# Altium schematic sheet Block_Diagram_2.SchDoc
size 558 x 431 mm; SheetNumber: 2; SheetTotal: 2
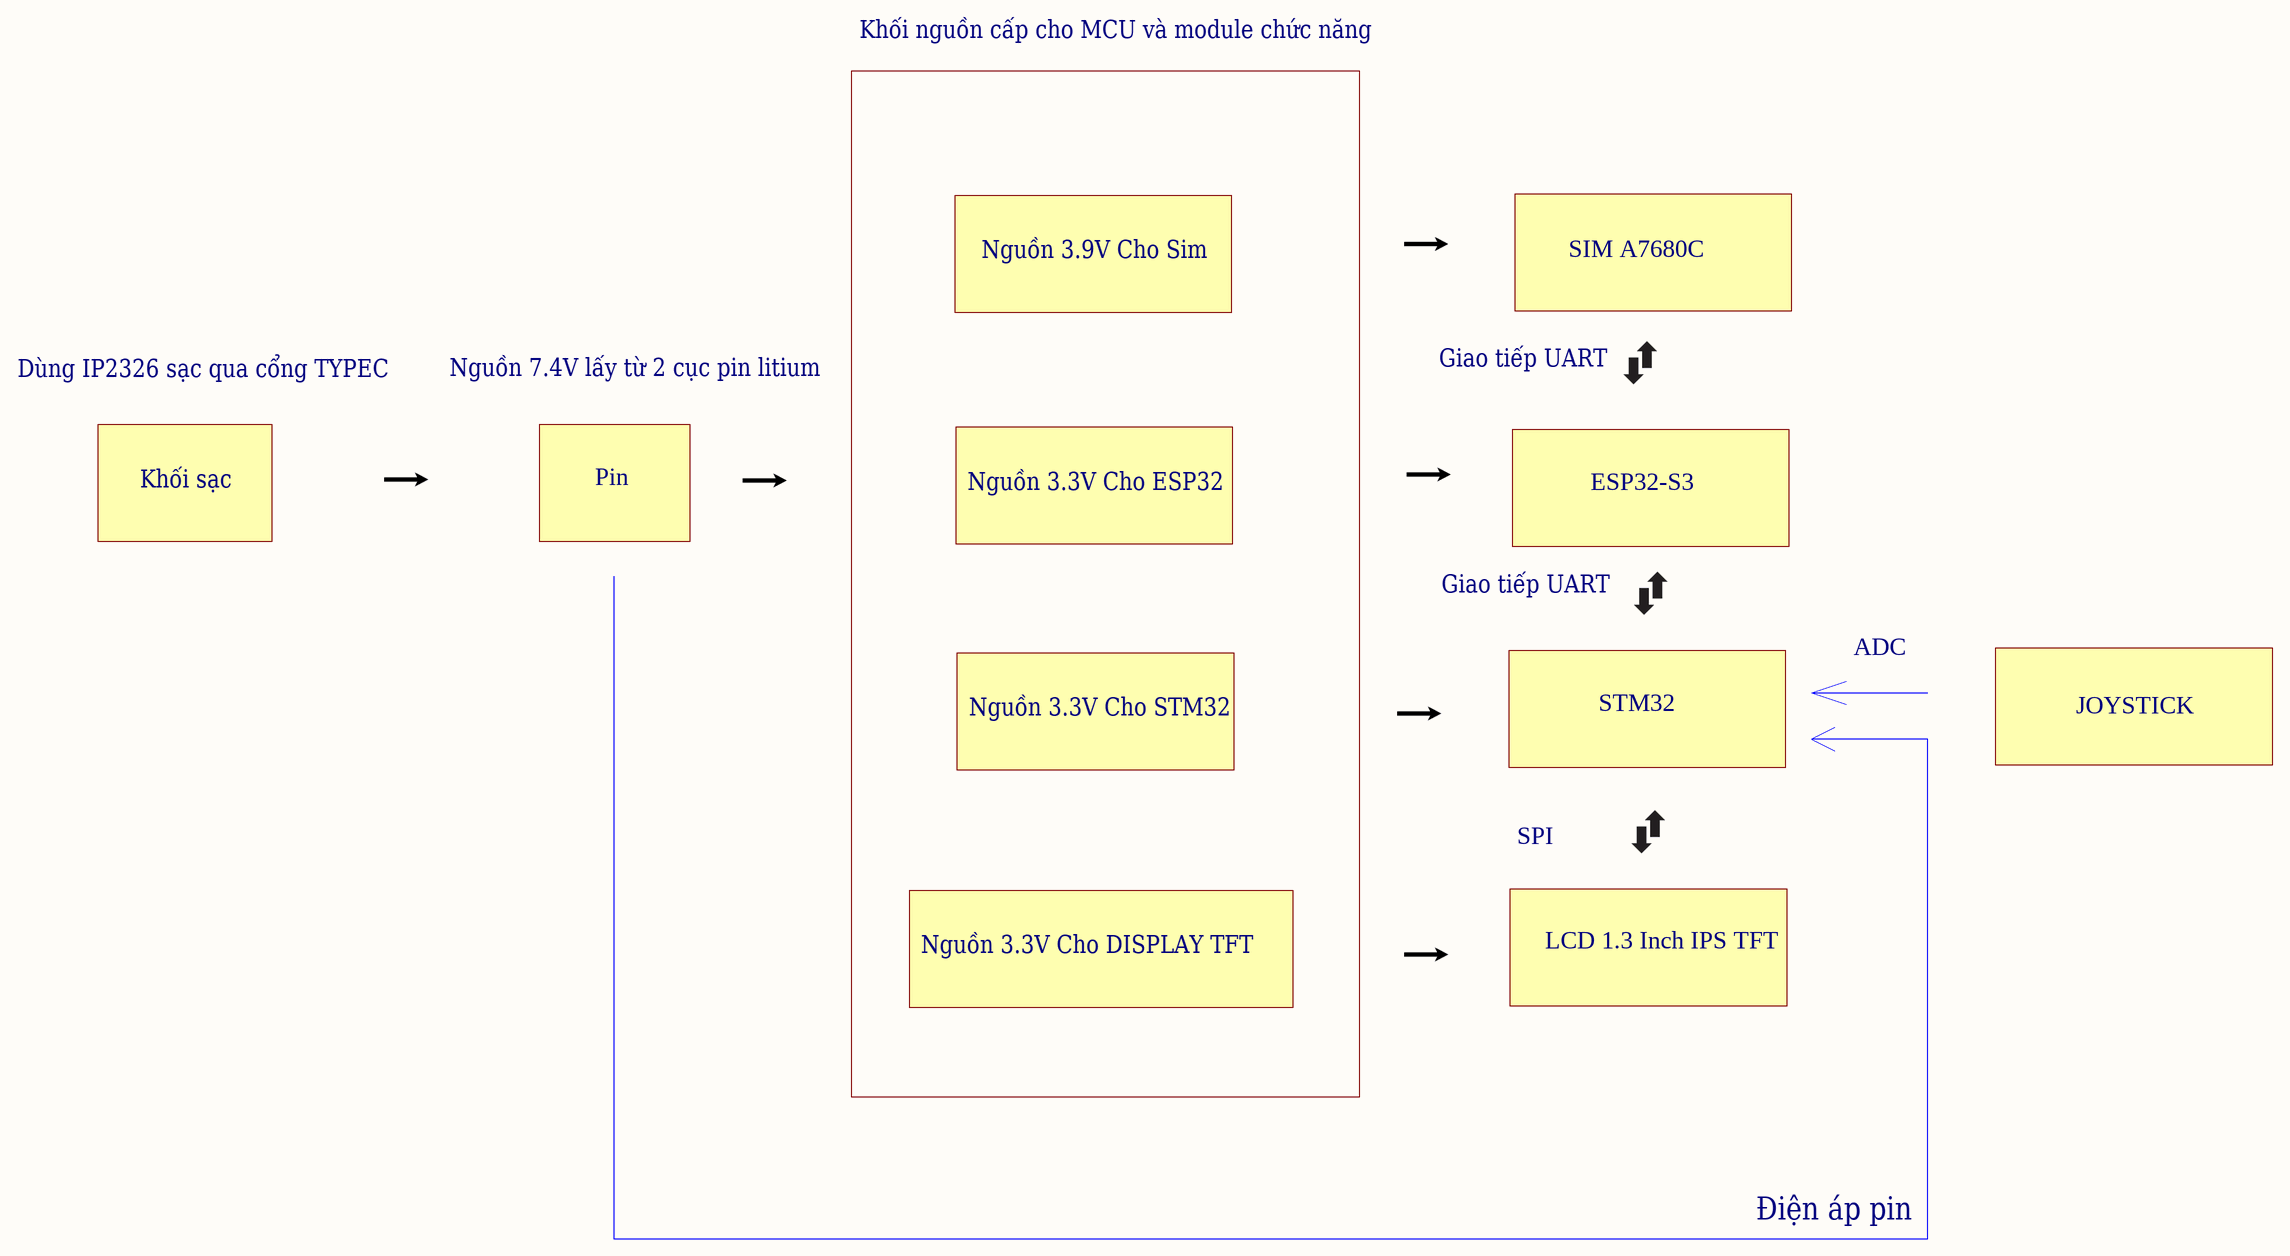
[diagram p0: Block_Diagram_2.SchDoc]

## Notes on the sheet
- Khối nguồn cấp cho MCU và module chức năng
- Nguồn 3.9V Cho Sim
- SIM A7680C
- Dùng IP2326 sạc qua cổng TYPEC
- Nguồn 7.4V lấy từ 2 cục pin litium
- Giao tiếp UART
- Khối sạc
- Pin
- Nguồn 3.3V Cho ESP32
- ESP32-S3
- ADC
- Nguồn 3.3V Cho STM32
- STM32
- JOYSTICK
- SPI
- Nguồn 3.3V Cho DISPLAY TFT
- LCD 1.3 Inch IPS TFT
- Điện áp pin
- DWG. NO.
- REV.
- SHT.
- REVISION
- DESCRIPTION
- DATE
- APPROVED
- THIS DOCUMENT AND THE DATA DISCLOSED HEREIN OR HEREWITH IS THE PROPERTY OF ALTIUM LIMITED AND MAY BE FREELY DISTRIBUTED IN WHOLE. NO RIGHTS ARE RESERVED OR EXPRESS OR IMPLIED WARANTEE GIVEN.
- ENG:
- DSN:
- APPROVALS
- PROJECT
- DOCUMENT REVISION:
- DESIGN ITEM:
- CHK:
- BOM:
- REFERENCE DOCUMENTS
- PROJECT REVISION:
- TITLE
- FAB DWG:
- PCB DWG:
- ASSY DWG:
- SCALE:
- SIZE
- C
- CAGE CODE
- FILE NAME
- DWG NO.
- SHEET
- OF
- REV